# Altium schematic sheet M12_Part_Right.SchDoc
size A3
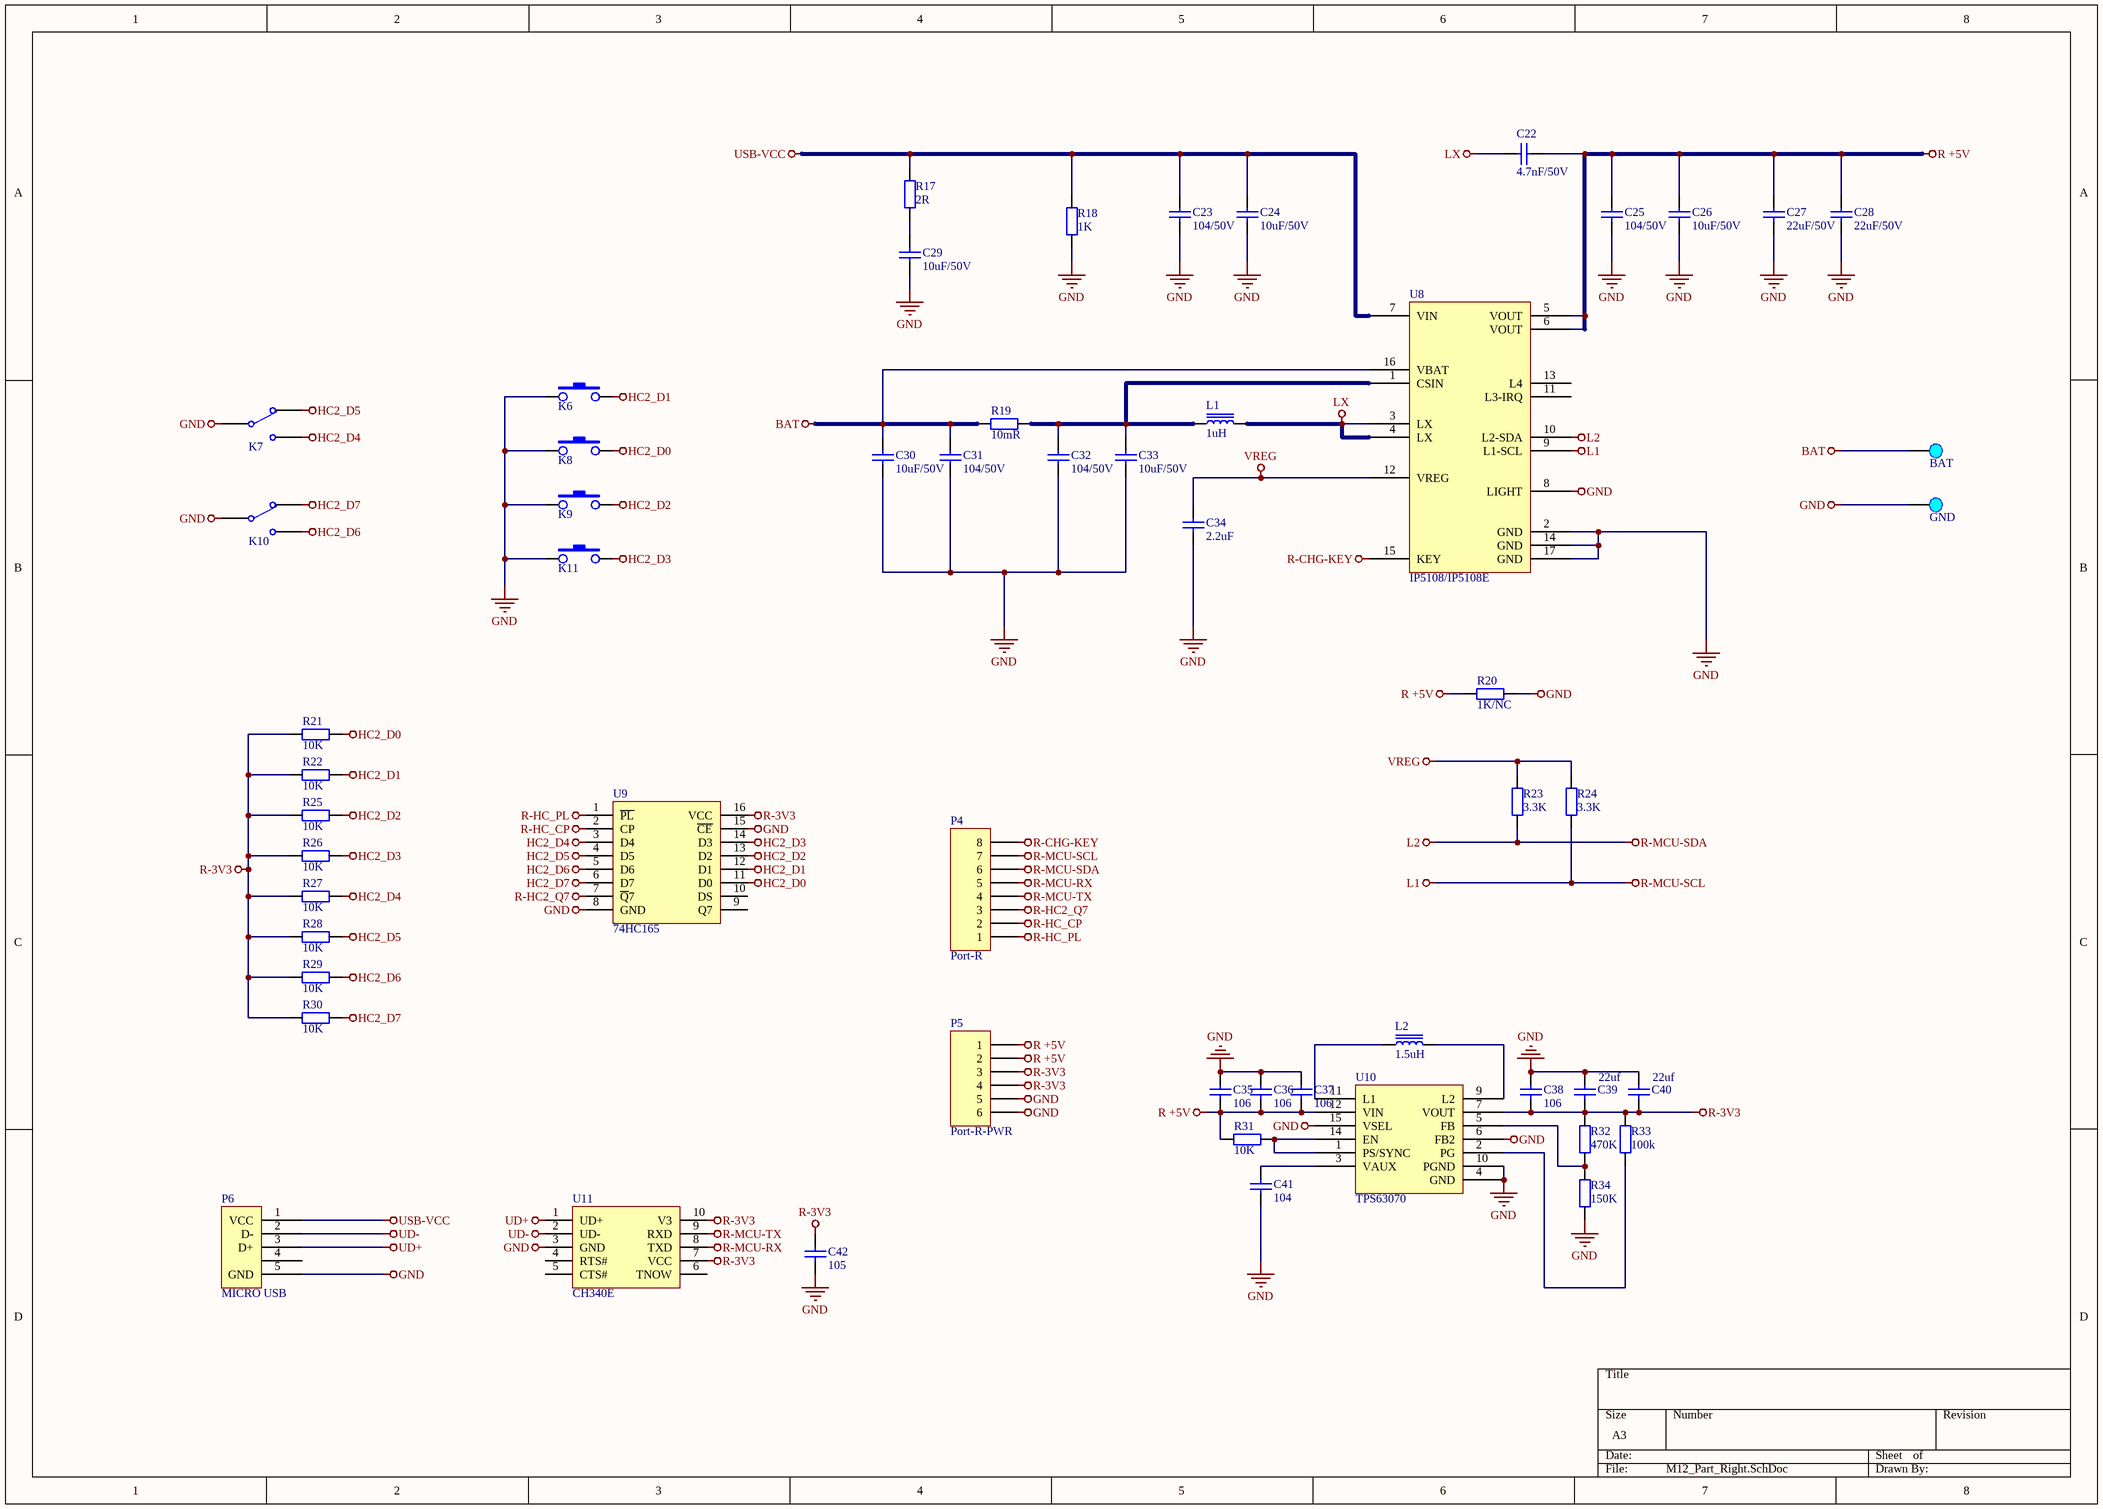
[diagram p0: M12_Part_Right.SchDoc]

## Parts
C22  _Parameter: 4.7nF/50V  [电容_C0603]  (hidden comment: 4.7nF)
C23  _Parameter: 104/50V  [电容_C0603]  (hidden comment: 104)
C24  _Parameter: 10uF/50V  [电容_C0603]  (hidden comment: 10uF)
C25  _Parameter: 104/50V  [电容_C0603]  (hidden comment: 104)
C26  _Parameter: 10uF/50V  [电容_C0603]  (hidden comment: 10uF)
C27  _Parameter: 22uF/50V  [电容_C1206]  (hidden comment: 22uF)
C28  _Parameter: 22uF/50V  [电容_C1206]  (hidden comment: 22uF)
C29  _Parameter: 10uF/50V  [电容_C0603]  (hidden comment: 10uF)
C30  _Parameter: 10uF/50V  [电容_C0603]  (hidden comment: 10uF)
C31  _Parameter: 104/50V  [电容_C0603]  (hidden comment: 104)
C32  _Parameter: 104/50V  [电容_C0603]  (hidden comment: 104)
C33  _Parameter: 10uF/50V  [电容_C0603]  (hidden comment: 10uF)
C34  _Parameter: 2.2uF  [电容_C0603]  (hidden comment: 104)
C35  106  [电容_C0603]
C36  106  [电容_C0603]
C37  106  [电容_C0603]
C38  106  [电容_C0603]
C39  22uf  [电容_C1206]
C40  22uf  [电容_C1206]
C41  104  [电容_C0603]
C42  105  [电容_C0603]
K6  SKRP  [KEY-SMD_4P-L6.0-W6.0-P3.90-LS10.0]  (value not drawn)
K7  *  [ZH1.5-WS-3P]  (value not drawn)
K8  SKRP  [KEY-SMD_4P-L6.0-W6.0-P3.90-LS10.0]  (value not drawn)
K9  SKRP  [KEY-SMD_4P-L6.0-W6.0-P3.90-LS10.0]  (value not drawn)
K10  *  [ZH1.5-WS-3P]  (value not drawn)
K11  SKRP  [KEY-SMD_4P-L6.0-W6.0-P3.90-LS10.0]  (value not drawn)
L1  1uH  [变压器电感_CD54]
L2  1.5uH  [变压器电感_0420]
P4  Port-R  [ZH1.5-WS-8P]
P5  Port-R-PWR  [ZH1.5-WS-6P]
P6  MICRO USB  [接插件_MICRO 牛角插座 USB 直边]
Pad1  BAT  [Pad_B]
Pad2  GND  [Pad_B]
R17  2R  [电阻_R0603]
R18  1K  [电阻_R0603]
R19  10mR  [电阻_R2512]
R20  1K/NC  [电阻_R0603]
R21  10K  [电阻_R0603]
R22  10K  [电阻_R0603]
R23  3.3K  [电阻_R0603]
R24  3.3K  [电阻_R0603]
R25  10K  [电阻_R0603]
R26  10K  [电阻_R0603]
R27  10K  [电阻_R0603]
R28  10K  [电阻_R0603]
R29  10K  [电阻_R0603]
R30  10K  [电阻_R0603]
R31  10K  [电阻_R0603]
R32  470K  [电阻_R0603]
R33  100k  [电阻_R0603]
R34  150K  [电阻_R0603]
U8  IP5108/IP5108E  [SOP16_PWR]
U9  74HC165  [74HC系列_SOP16]
U10  TPS63070  [VQFN-15-HR]
U11  CH340E  [串口_MSOP10]

## Nets
BAT: C30.2 C31.2 Pad1.1 R19.1 U8.16(VBAT)
GND: C23.1 C24.1 C25.1 C26.1 C27.1 C28.1 C29.1 C30.1 C31.1 C32.1 C33.1 C34.1 C35.2 C36.2 C37.2 C38.2 C39.2 C40.2 C41.1 C42.1 K6.1 K7.1 K8.1 K9.1 K10.1 K11.1 P5.5 P5.6 P6.0 P6.5(GND) Pad2.1 R18.2 R20.2 R34.2 U8.2(GND) U8.8(LIGHT) U8.14(GND) U8.17(GND) U9.8(GND) U9.15(~{CE}) U10.4(GND) U10.6(FB2) U10.10(PGND) U10.15(VSEL) U11.3(GND)
HC2_D0: K8.2 R21.2 U9.11(D0)
HC2_D1: K6.2 R22.2 U9.12(D1)
HC2_D2: K9.2 R25.2 U9.13(D2)
HC2_D3: K11.2 R26.2 U9.14(D3)
HC2_D4: K7.3 R27.2 U9.3(D4)
HC2_D5: K7.2 R28.2 U9.4(D5)
HC2_D6: K10.3 R29.2 U9.5(D6)
HC2_D7: K10.2 R30.2 U9.6(D7)
L1: P4.7 R24.1 U8.9(L1-SCL)  [also labelled R-MCU-SCL]
L2: P4.6 R23.1 U8.10(L2-SDA)  [also labelled R-MCU-SDA]
LX: C22.2 L1.2 U8.3(LX) U8.4(LX)
R +5V: C22.1 C25.2 C26.2 C27.2 C28.2 C35.1 C36.1 C37.1 P5.1 P5.2 R20.1 R31.2 U8.5(VOUT) U8.6(VOUT) U10.12(VIN)
R-3V3: C38.1 C39.1 C40.1 C42.2 P5.3 P5.4 R21.1 R22.1 R25.1 R26.1 R27.1 R28.1 R29.1 R30.1 R32.1 R33.1 U9.16(VCC) U10.7(VOUT) U11.7(VCC) U11.10(V3)
R-CHG-KEY: P4.8 U8.15(KEY)
R-HC2_Q7: P4.3 U9.7(~{Q}7)
R-HC_CP: P4.2 U9.2(CP)
R-HC_PL: P4.1 U9.1(~{PL})
R-MCU-RX: P4.5 U11.8(TXD)
R-MCU-TX: P4.4 U11.9(RXD)
UD+: P6.3(D+) U11.1(UD+)
UD-: P6.2(D-) U11.2(UD-)
USB-VCC: C23.2 C24.2 P6.1(VCC) R17.1 R18.1 U8.7(VIN)
VREG: C34.2 R23.2 R24.2 U8.12(VREG)
NetC29_2: C29.2 R17.2
NetC32_2: C32.2 C33.2 L1.1 R19.2 U8.1(CSIN)
NetC41_2: C41.2 U10.3(VAUX)
NetL2_1: L2.1 U10.11(L1)
NetL2_2: L2.2 U10.9(L2)
NetR31_1: R31.1 U10.1(PS/SYNC) U10.14(EN)
NetR32_2: R32.2 R34.1 U10.5(FB)
NetR33_2: R33.2 U10.2(PG)

Not connected (* = marked no-connect by the designer): P6 4; U8 11(L3-IRQ) 13(L4); U9 9(Q7) 10(DS); U11 4(RTS#) 5(CTS#) 6(TNOW)

## Library data of the parts
C22 = Cap: _Material: X7R; _Voltage: 50V; _Slash: /; _Specification: Cap,0805,X7R,4.7nF,50V,10%; _Comma: ,; _Accuracy: 10%; _Footprint: 0805; _Capacitance: 4.7nF; _Name: Cap
C23 C25 C31 C32 C34 = Cap: _Material: X7R; _Voltage: 50V; _Slash: /; _Specification: Cap,0805,X7R,104,50V,10%; _Comma: ,; _Accuracy: 10%; _Footprint: 0805; _Capacitance: 104; _Name: Cap
C24 C26 C29 C30 C33 = Cap: _Material: X7R; _Voltage: 50V; _Slash: /; _Specification: Cap,0805,X7R,10uF,50V,10%; _Comma: ,; _Accuracy: 10%; _Footprint: 0805; _Capacitance: 10uF; _Name: Cap
C27 C28 = Cap: _Material: X7R; _Voltage: 50V; _Slash: /; _Specification: Cap,0805,X7R,22uF,50V,10%; _Comma: ,; _Accuracy: 10%; _Footprint: 0805; _Capacitance: 22uF; _Name: Cap
C35-C42 = cap: U: 50V; 参数: Cap,0805,X7R,104K,50V,125C,±10%
  C35-C38: C: 106
  C39 C40: C: 22uf
  C41: C: 104
  C42: C: 105
K6 K8 K9 K11 = SW-PB: _Comma: ,; _Name: KEY; _Specification: KEY,SKRP,*; _Footprint: *; _Model: SKRP
K7 K10 = KEY-3: pin to pad: 1>2 2>1; _Comma: ,; _Footprint: KEY-3*6; _Name: Switch; _Specification: Switch,*,KEY-3*6; _Model: *
L1 = Inductor Iron 2: _Current: 10A; _Accuracy: 20%; _Footprint: 1040; _Name: IND; _Specification: IND,1040,1uH,10A,20%; _Comma: ,; _Value: 1uH
L2 = Inductor Iron 2: _Current: 10A; _Accuracy: 20%; _Footprint: 1040; _Name: IND; _Specification: IND,1040,1.5uH,10A,20%; _Comma: ,; _Value: 1.5uH
P4 = Header 8: Header, 8-Pin; LatestRevisionDate: 17-Jul-2002; LatestRevisionNote: Re-released for DXP Platform.; Publisher: Altium Limited
P5 = Header 6: Header, 6-Pin; LatestRevisionDate: 17-Jul-2002; LatestRevisionNote: Re-released for DXP Platform.; Publisher: Altium Limited
P6 = MICRO USB 5PIN: _Comma: ,; _Name: Port; _Specification: Port,MICRO USB,5PIN; _Value: 5PIN; _Model: MICRO USB
Pad1 = Pad: _Funcyusa: Test; _Specification: Pad,Test,BAT; _Comma: ,; _Name: Pad; _Remarks: BAT
Pad2 = Pad: _Funcyusa: Test; _Specification: Pad,Test,GND; _Comma: ,; _Name: Pad; _Remarks: GND
R17 = Res: _Accuracy: 1%; _Power: 1/8W; _Footprint: 0805; _Drift: 100ppm; _Comma: ,; _Specification: Res,0805,2R,1%,1/8W,100ppm; _Name: Res; _Value: 2R
R18 = Res: _Accuracy: 1%; _Power: 1/8W; _Footprint: 0805; _Drift: 100ppm; _Comma: ,; _Specification: Res,0805,1K,1%,1/8W,100ppm; _Name: Res; _Value: 1K
R19 = Res: _Accuracy: 1%; _Power: 1/8W; _Footprint: 0805; _Drift: 100ppm; _Comma: ,; _Specification: Res,0805,10mR,1%,1/8W,100ppm; _Name: Res; _Value: 10mR
R20 = Res: _Accuracy: 1%; _Power: 1/8W; _Footprint: 0805; _Drift: 100ppm; _Comma: ,; _Specification: Res,0805,1K/NC,1%,1/8W,100ppm; _Name: Res; _Value: 1K/NC
R21 R22 R25-R34 = Res: P: 1/8W; 参数: Res,0805,0R,±1%,1/8W,100ppm,155C
  R21 R22 R25-R31: R: 10K
  R32: R: 470K
  R33: R: 100k
  R34: R: 150K
R23 R24 = Res: _Accuracy: 1%; _Power: 1/8W; _Footprint: 0805; _Drift: 100ppm; _Comma: ,; _Specification: Res,0805,3.3K,1%,1/8W,100ppm; _Name: Res; _Value: 3.3K
U8 = IP5108/IP5108E: 2A/1A Charger SoC
U10 = TPS63070: 降压-升压转换器
U11 = CH340E: _Comma: ,; _Footprint: MSOP10; _Name: USB-UART; _Specification: USB-UART,CH340E,MSOP10; _Model: CH340E